# Altium schematic sheet biv2-batb_1a.SchDoc: Плата RF1-PWC
size 420 x 297 mm; ApprovedBy: Судаков; CheckedBy: Сарайкин; Author: Аршаница; CompanyName: ООО "ОКБ Вектор"; Address1: Address1; Address2: Address2; Address3: Address3; Address4: Address4; DocumentNumber: ВГАР.563131.002 Э3; SheetNumber: 1; SheetTotal: 1; Scale: 1:1; ProcessInspection: Казанов; NormInspection: Коваленко; FirstReferrence: ВГАР.563131.002
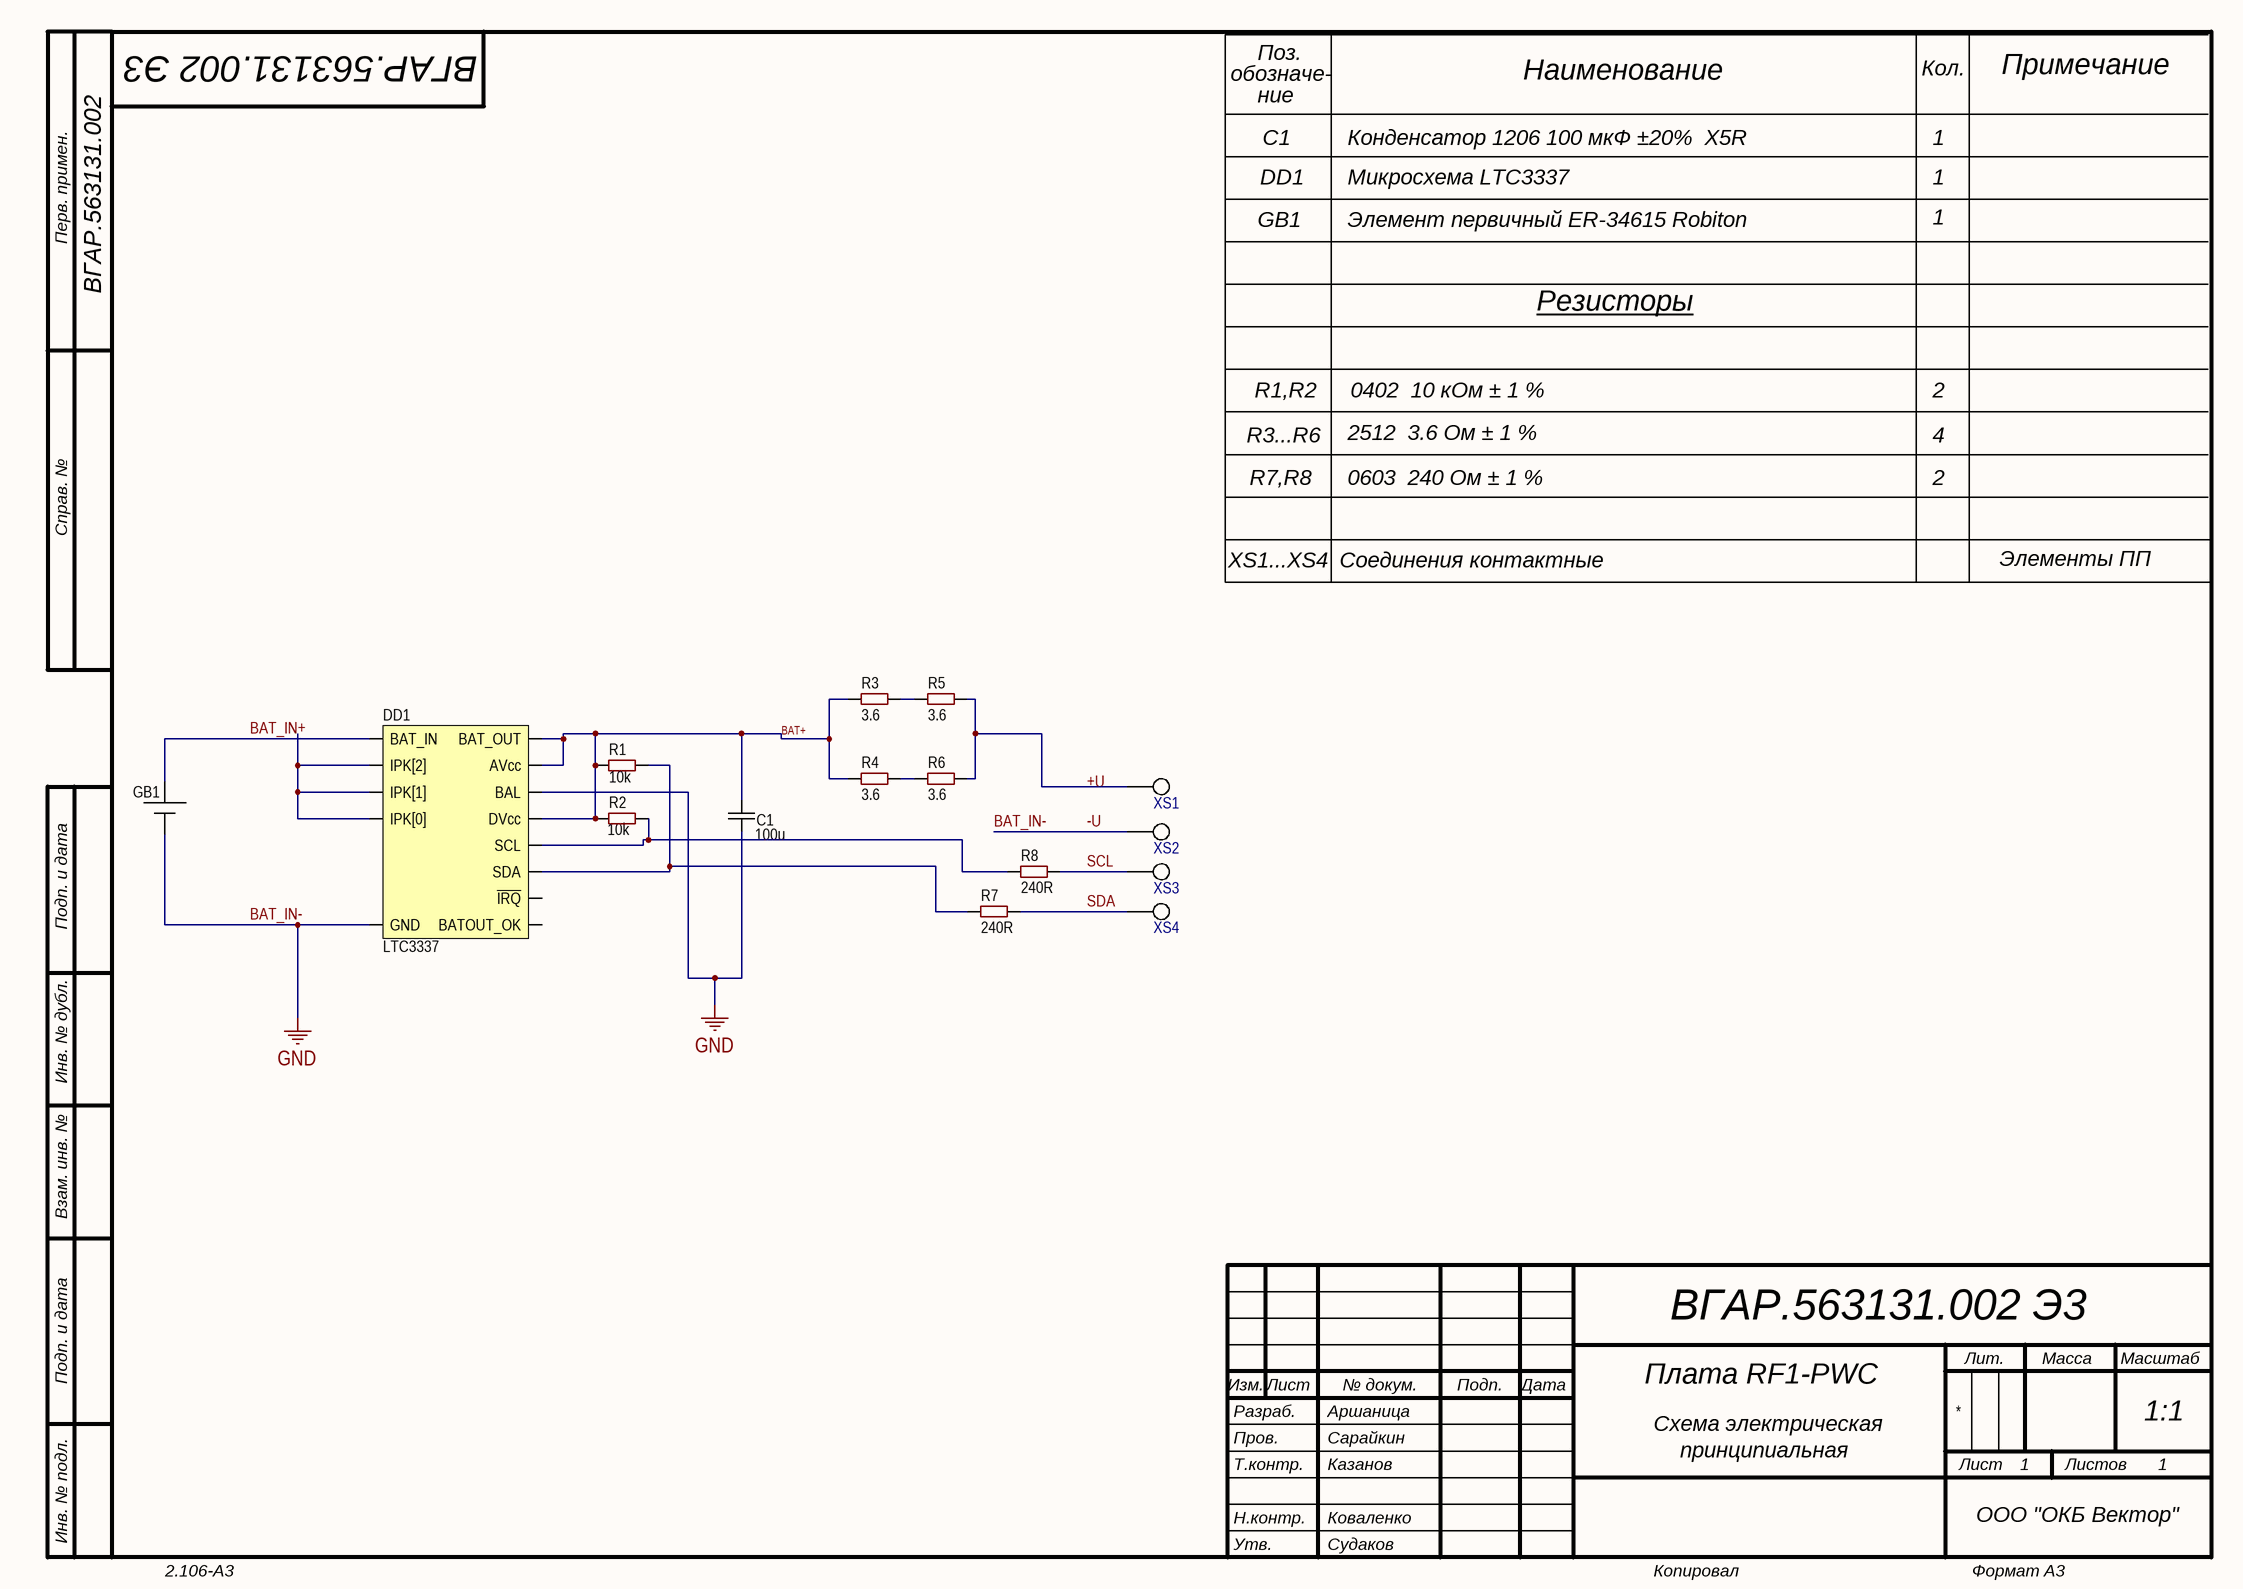
[diagram p0: biv2-batb_1a.SchDoc]

## Parts
C1  value 100u  [CAP: 1206]
DD1  LTC3337  [12-LFCSP]
R1  value 10k  [RES: 0402]
R2  value 10k  [RES: 0402]
R3  value 3.6  [RES: 2512]
R4  value 3.6  [RES: 2512]
R5  value 3.6  [RES: 2512]
R6  value 3.6  [RES: 2512]
R7  value 240R  [RES: 0603]
R8  value 240R  [RES: 0603]
XS1  Testpoint_HS1mm  [TestPoint(without 3D)]  (value not drawn)
XS2  Testpoint_HS1mm  [TestPoint(without 3D)]  (value not drawn)
XS3  Testpoint_HS1mm  [TestPoint(without 3D)]  (value not drawn)
XS4  Testpoint_HS1mm  [TestPoint(without 3D)]  (value not drawn)

## Nets
-U: C1.1 DD1.1(BAL) DD1.13(GND) XS2.1  [also labelled BAT_IN-, GND]
BAT+: C1.2 DD1.2(AVcc) DD1.3(DVcc) DD1.12(BAT_OUT) R1.1 R2.1 R3.1 R4.1
BAT_IN+: DD1.11(BAT_IN)
SCL: R8.2 XS3.1
SDA: R7.2 XS4.1
NetDD1_4: DD1.4(SCL) R2.2 R8.1
NetDD1_5: DD1.5(SDA) R1.2 R7.1
NetDD1_8: DD1.8(IPK[2]) DD1.9(IPK[1]) DD1.10(IPK[0])
NetR3_2: R3.2 R5.1
NetR4_2: R4.2 R6.1
NetR5_2: R5.2 R6.2 XS1.1

Not connected (* = marked no-connect by the designer): DD1 6(~{IRQ}) 7(BATOUT_OK)

## Notes on the sheet
- обозначе-
- Поз.
- ние
- Наименование
- Кол.
- Примечание
- DD1
- С1
- Микросхема LTC3337
- Конденсатор 1206 100 мкФ ±20%  X5R
- 1
- GB1
- Элемент первичный ER-34615 Robiton
- Резисторы
- R3...R6
- R1,R2
- 2512  3.6 Ом ± 1 %
- 0402  10 кОм ± 1 %
- 2
- 4
- R7,R8
- 0603  240 Ом ± 1 %
- XS1...XS4
- Соединения контактные
- Элементы ПП
- Схема электрическая
- принципиальная
- Labels drawn without touching a wire or pin: +U
- Перв. примен.
- Справ. №
- Подп. и дата
- Инв. № дубл.
- Взам. инв. №
- Разраб.
- Изм.
- Лист
- № докум.
- Подп.
- Дата
- Лит.
- Масса
- Масштаб
- Пров.
- Т.контр.
- Листов
- Инв. № подл.
- Утв.
- Н.контр.
- 2.106-A3
- Копировал
- Формат А3

## Library data of the parts
C1 = Ceramic_1206: Manufacturer: Yageo; PartNumber: CC1206KRX7R9BB104; ValueManufacturerPartNumber: Ceramic capacitor, 100u, X7R, ±10%, 6V, 1206, -55...+125°C; TypeCapacitor: Ceramic capacitor; Tolerance: ±10%; TypeDielectric: X7R; Voltage: 6V; Package: 1206; HelpURL: https://www.digikey.com/product-detail/en/yageo/CC1206KRX7R9BB104/311-1179-1-ND/303089; Temperature: -55...+125°C
DD1 = LTC3337: Battery SOH monitor; ComponentLink1Description: Datasheet; ComponentLink1URL: https://www.analog.com/en/products/ltc3337.html
R1 R2 = Resistor_0402: Manufacturer: Yageo; PartNumber: RC0402JR-07100RL; TypeResistor: Resistor film; Power: 0.063W; Package: 0402; HelpURL: https://www.digikey.com/product-detail/en/yageo/RC0402JR-07100RL/311-100JRCT-ND/729362; ValueManufacturerPartNumber: =TypeResistor+', '+Value+', '+Tolerance+', '+Package+', '+Power+', '+Temperature; Temperature: -55...+125°C
R3-R6 = Resistor_2512: Manufacturer: Yageo; PartNumber: RC2512JK-07100RL; ValueManufacturerPartNumber: Resistor film, 3.6, ±5%, 2512, 1W, -55...+125°C; TypeResistor: Resistor film; Power: 1W; Tolerance: ±5%; Package: 2512; HelpURL: https://www.digikey.com/product-detail/en/yageo/RC2512JK-07100RL/YAG3393CT-ND/5962215; Temperature: -55...+125°C
R7 R8 = Resistor_0603: Manufacturer: Yageo; PartNumber: RC0603JR-07100RL; ValueManufacturerPartNumber: Resistor film, 240R, ±5%, 0603, 0.1W, -55...+125°C; TypeResistor: Resistor film; Power: 0.1W; Tolerance: ±5%; Package: 0603; HelpURL: https://www.digikey.com/product-detail/en/yageo/RC0603JR-07100RL/311-100GRCT-ND/729644; Temperature: -55...+125°C